# Altium schematic sheet rj45_bnc.SchDoc
size A4; CompanyName: Technische Hochschule Nürnberg Georg Simon Ohm; Organization: UltraZohm; Address1: Kesslerplatz 12; Address2: 90489 Nürnberg; Address3: GERMANY; SheetNumber: 2; SheetTotal: 2; Website: www.ultrazohm.com
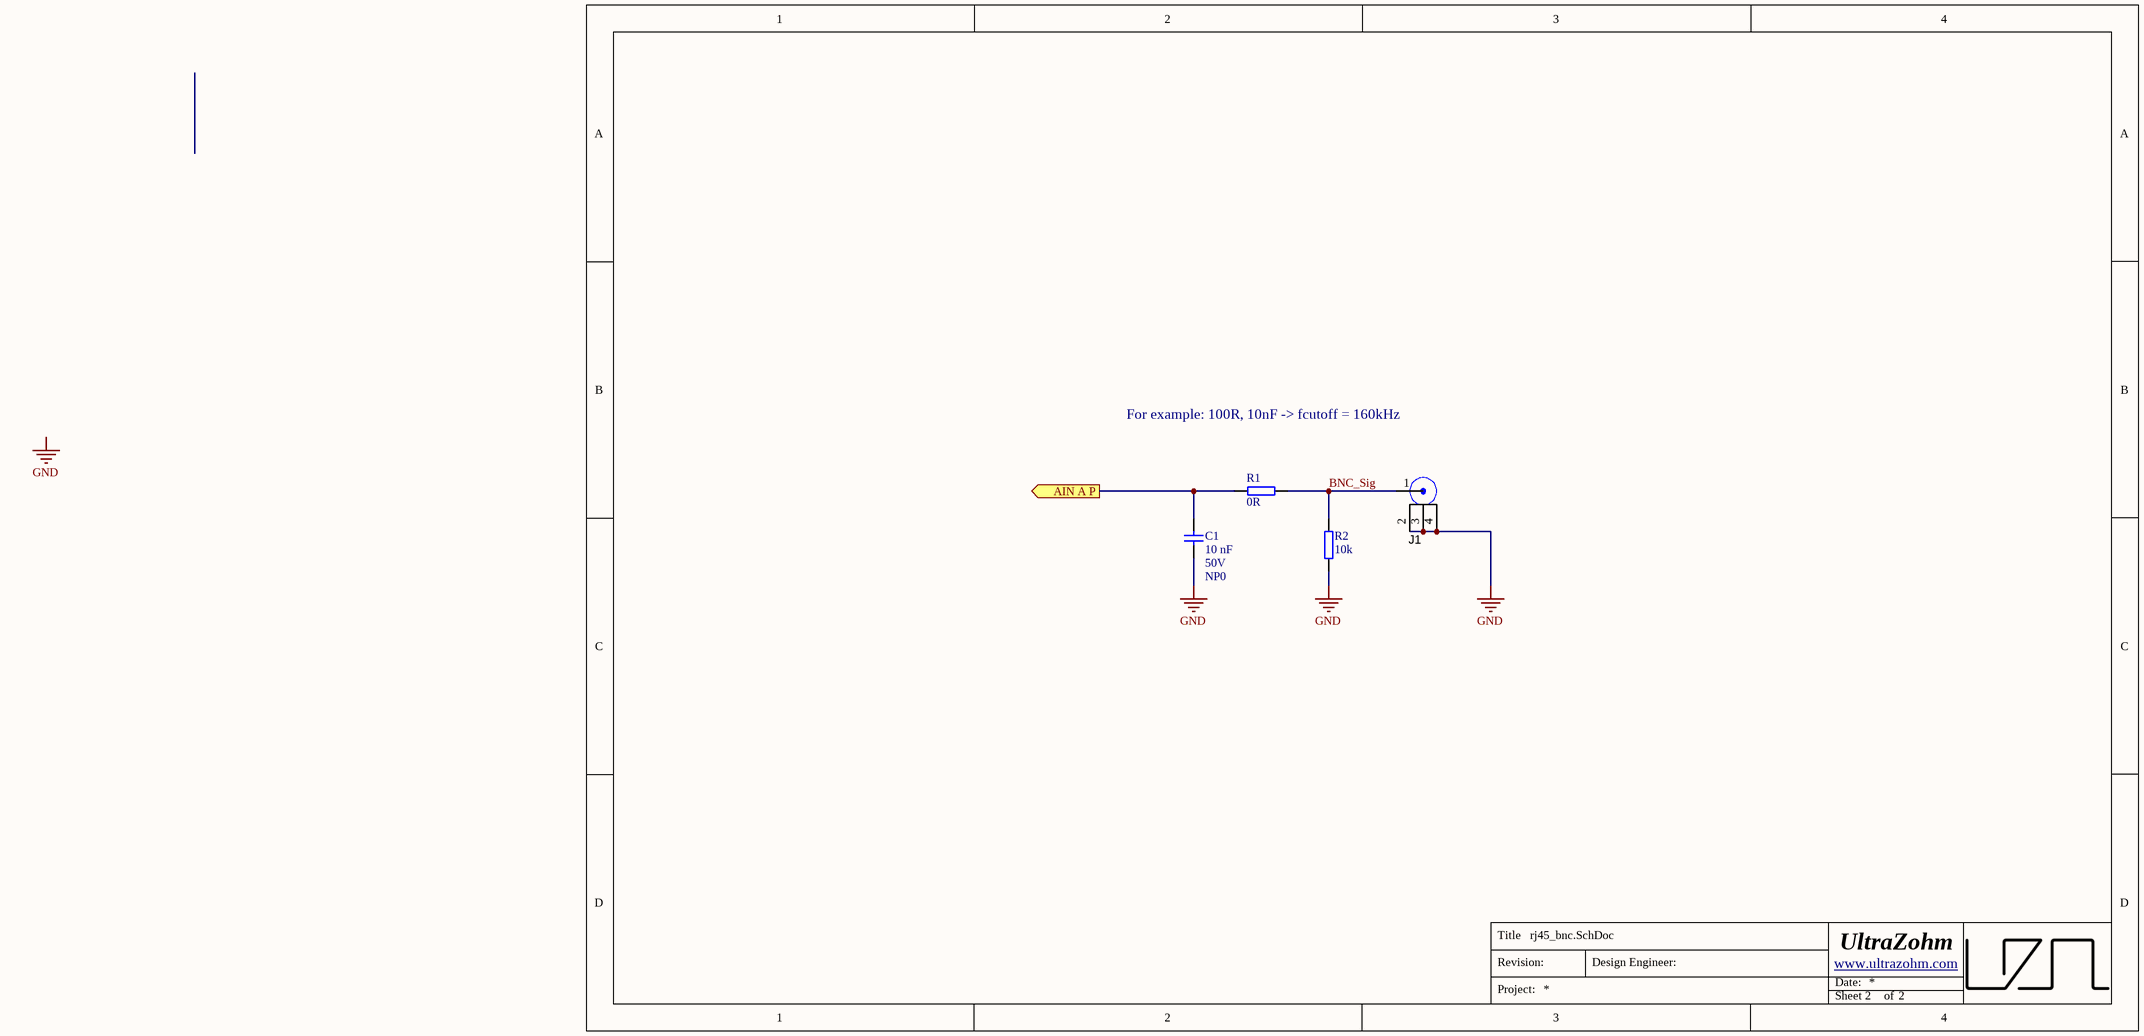
[diagram p0: rj45_bnc.SchDoc]

## Parts
C1  10 nF  Voltage: 50V  Technology: NP0  [C_0603_TE]
J1  (no value)  [Right Angle BNC]
R1  0R  [R_0603_TE]
R2  10k  [R_0603_TE]

## Ports
AIN A P (out)

## Nets
GND: C1.2 J1.2 J1.3 J1.4 R2.1
AIN A P: C1.1 R1.2 ; port AIN A P
BNC_Sig: J1.1 R1.1 R2.2

## Notes on the sheet
- For example: 100R, 10nF -> fcutoff = 160kHz
- Labels drawn without touching a wire or pin: GND
- Title
- Revision:
- Design Engineer:
- Date:
- Project:
- Sheet
- of

## Library data of the parts
C1 = UZgen_C_0603_10nF_50V_NP0: Generic capacitor; Manufacturer: UZgen; Tolerance: 10 %; Created from: UZgenTool; Manufacturer Part Number: UZgen_C_0603_10nF_50V_NP0; PartID: 5806; Created On: 13.12.2024 11:08:49; Value: 10 nF; Device Package: 0603; Mounting Type: SMD; Last Updated: 13.12.2024 11:08:49
J1 = 5227661-1: RF Connectors / Coaxial Connectors 50 Ohm BNC Jack and Plug / right-angle; Manufacturer: TE Connectivity; PartNumber: Used in BOM report; SymbolVersion: use current date i.e. 2008-05-20; SymbolCreator: Use LDAP id; CompType: Used in some BOM reports.  Useful for finding later.; U/M: EA, IN, or GM; Created from: EAufderheide; MountType: SMT, TH, or N/A; RoHS: Used in BOM report.  Use Y or N.; PackageReference: eg:  0603, used in PnP report; ComponentLink1Description: Datasheet; ComponentLink1URL: https://www.te.com/commerce/DocumentDelivery/DDEController?Action=srchrtrv&DocNm=1307191_BNC_Connectors&DocType=Catalog%20Section&DocLang=English&PartCntxt=5227661-1&DocFormat=pdf; Alternate PartNumber: -; Alternate Manufacturer: -; Supplier 1: Mouser; Supplier Part Number 1: 571-5227661-1; Manufacturer Part Number: 5227661-1; PartID: 71; Created On: 16.01.2026 12:04:20; Last Updated: 16.01.2026 12:45:05; Mounting Type: THT; Operating Temperature: -65 °C to +125 °C; Series: BNC; Supplier 2: LCSC; Supplier Part Number 2: C2979611; Value: 5227661-1; LCSC Part Number: C2979611; Supplier 3: LCSC; Supplier Part Number 3: C305920
R1 = UZgen_R_0603_0R: Generic resistor; Manufacturer: UZgen; Tolerance: 1 %; Created from: UZgenTool; Manufacturer Part Number: UZgen_R_0603_0R; PartID: 581; Created On: 08.07.2024 14:34:30; Value: 0R; Device Package: 0603; Mounting Type: SMD; Last Updated: 08.07.2024 14:34:30; LCSC Part Number: C21189
R2 = UZgen_R_0603_10k: Generic resistor; Manufacturer: UZgen; Tolerance: 1 %; Created from: AGeiger; Manufacturer Part Number: UZgen_R_0603_10k; PartID: 1; Created On: 02.07.2024 14:34:53; Value: 10k; Device Package: 0603; Mounting Type: SMD; Last Updated: 02.07.2024 14:37:16